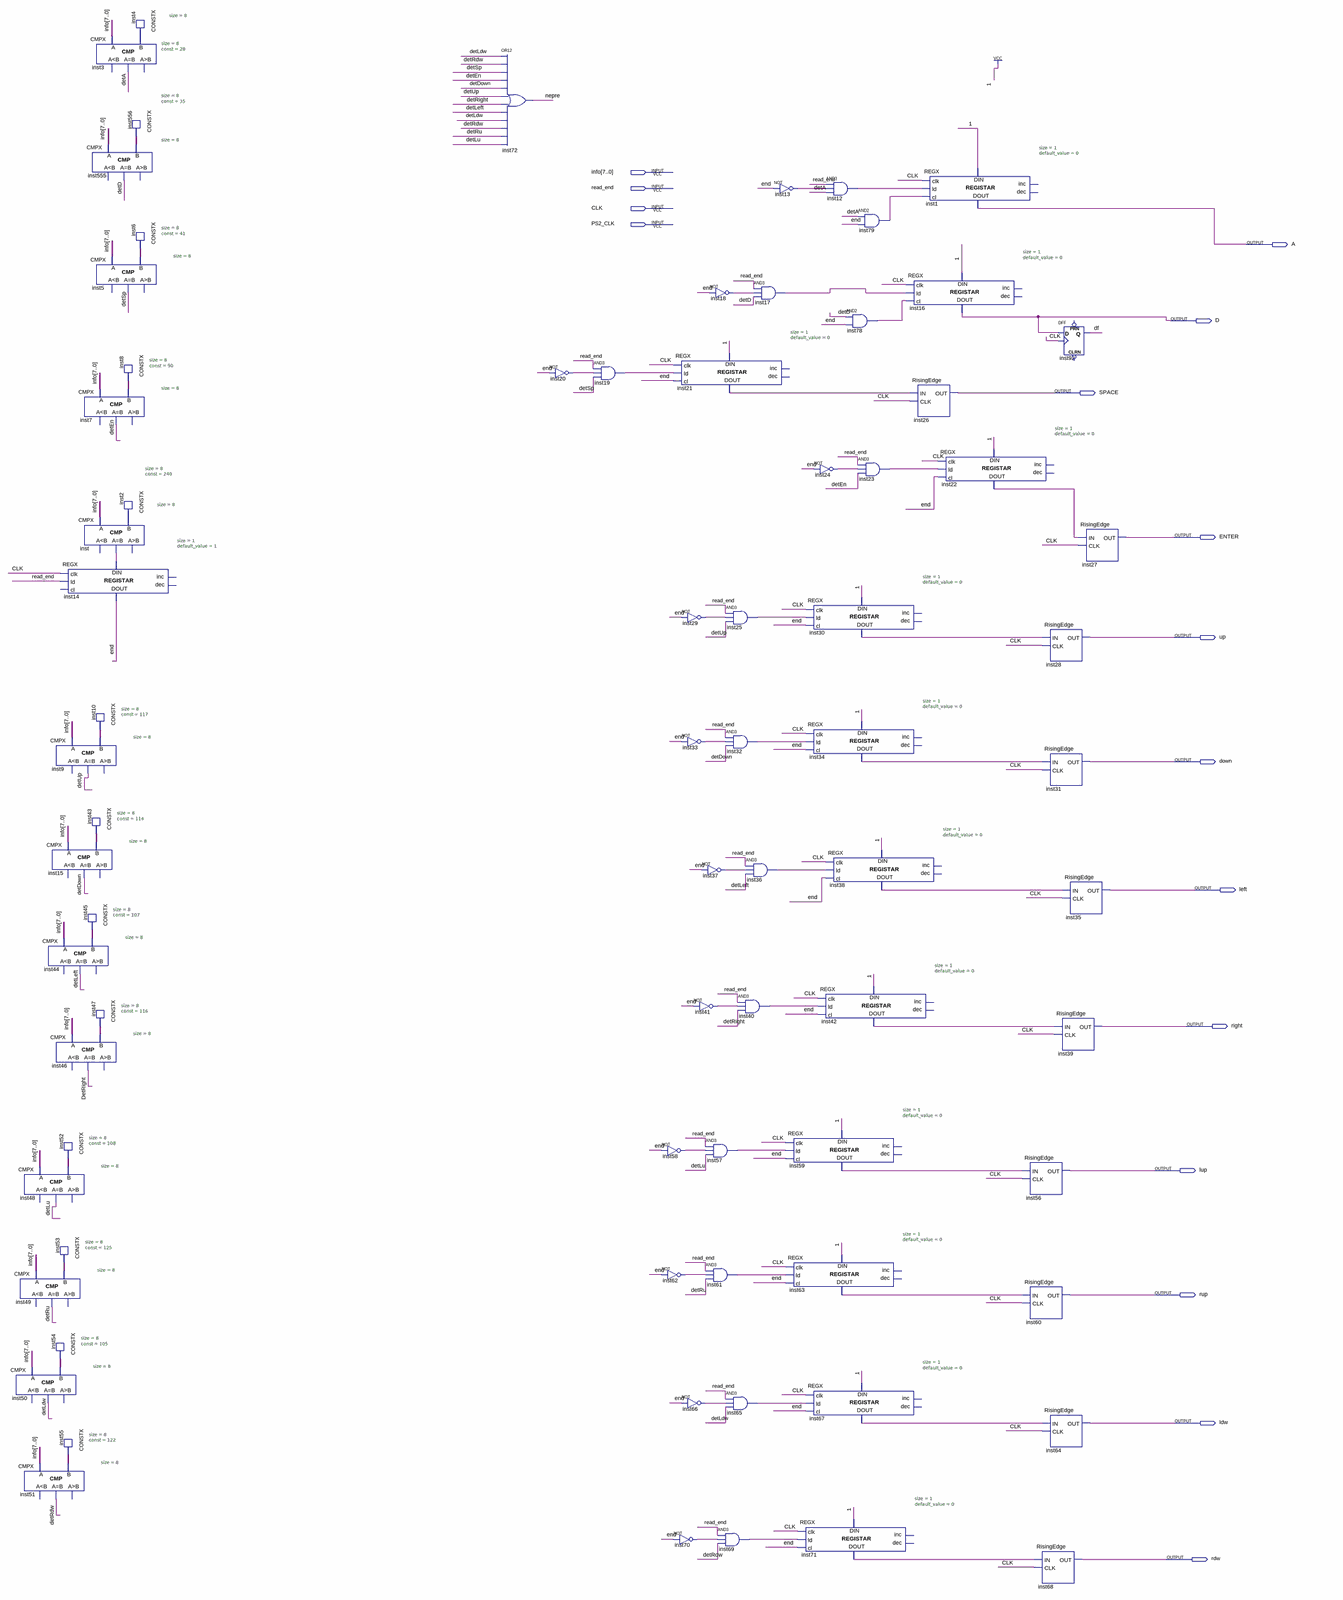
[diagram p0: schematic sheet, whole]
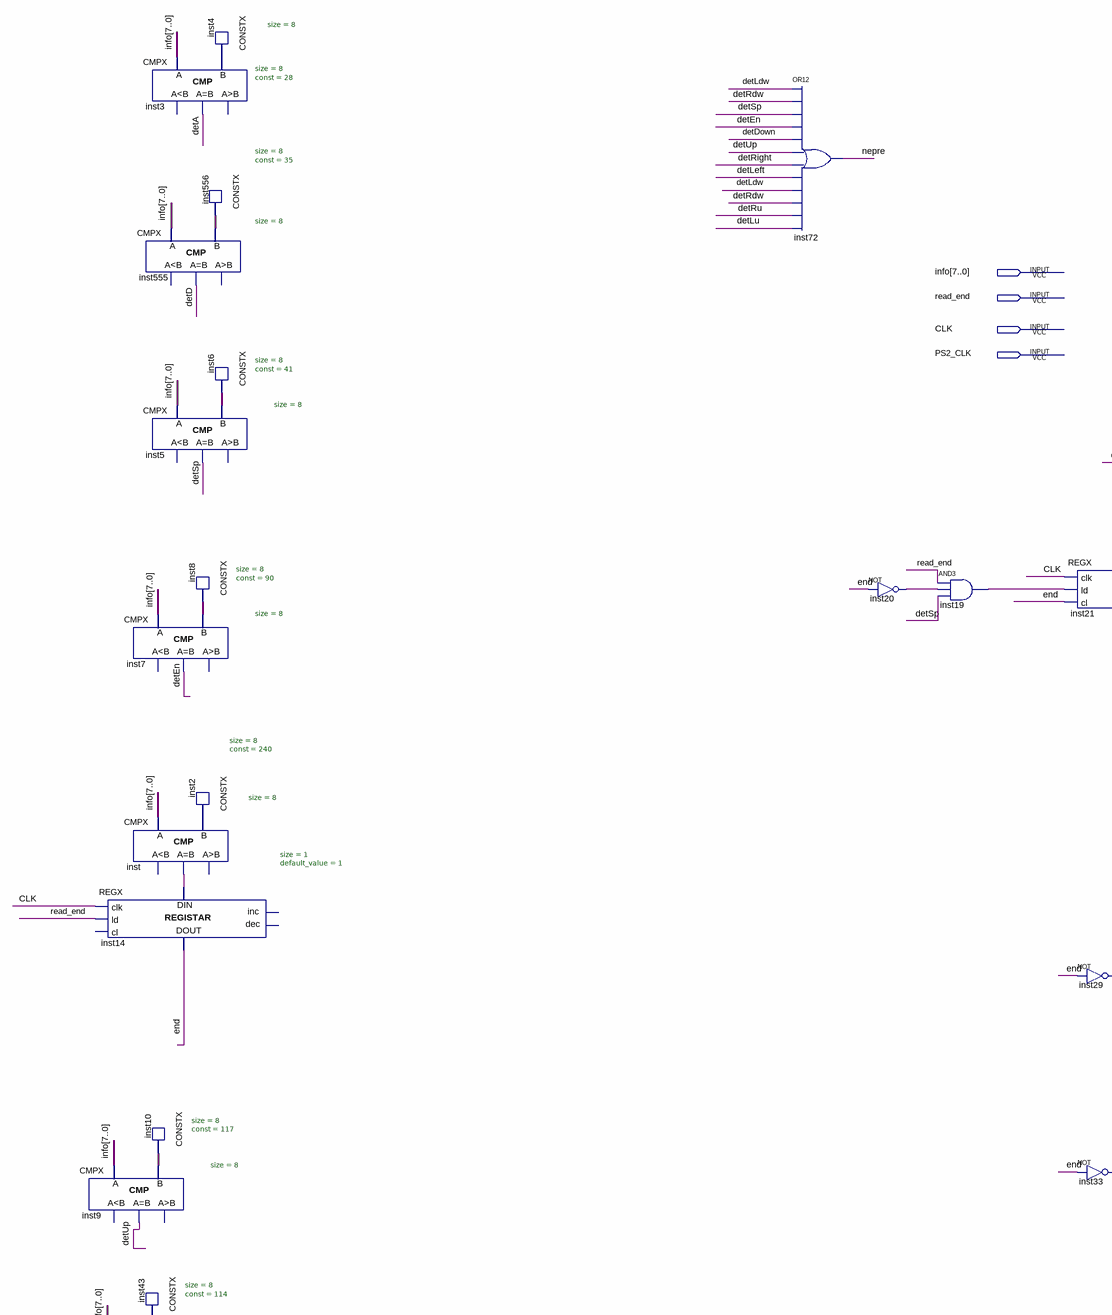
[diagram p1: schematic sheet, upper left part]
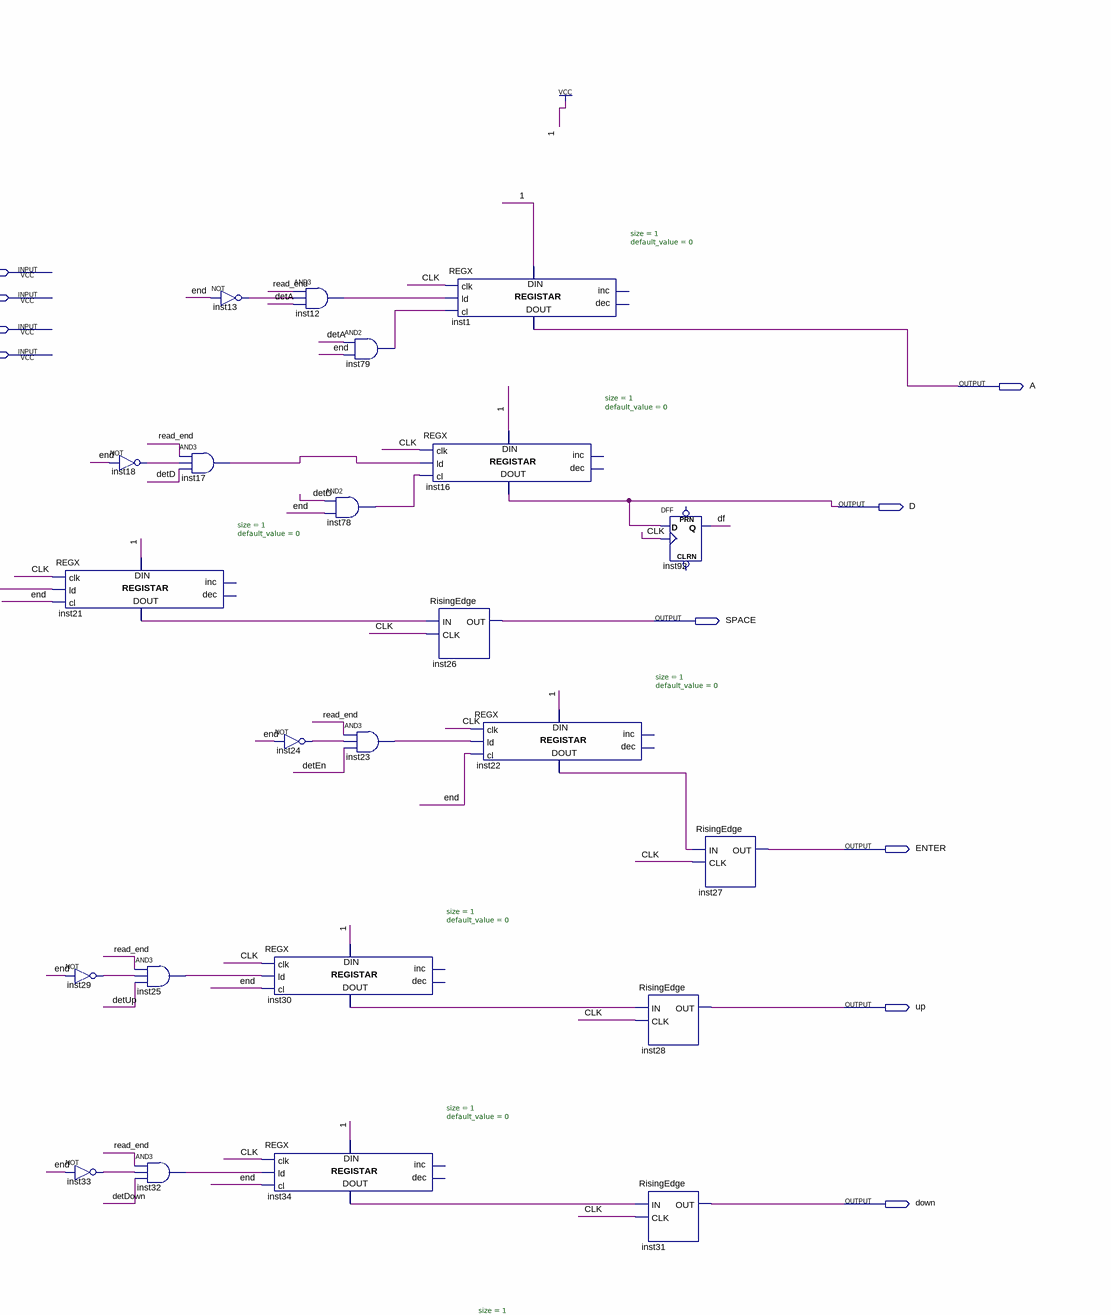
[diagram p2: schematic sheet, upper right part]
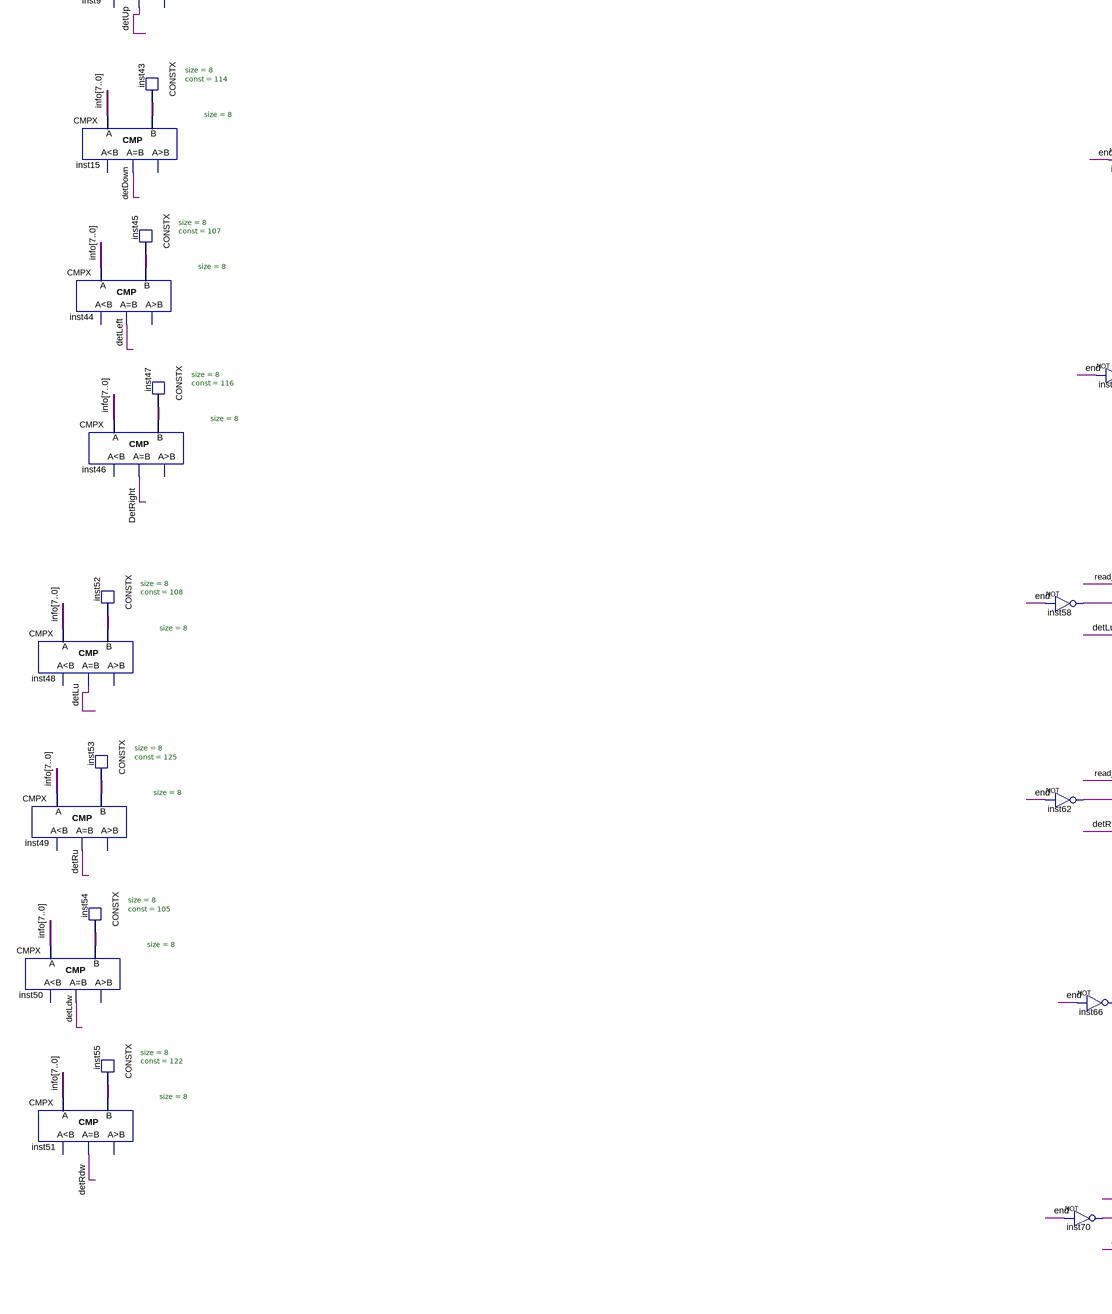
[diagram p3: schematic sheet, lower left part]
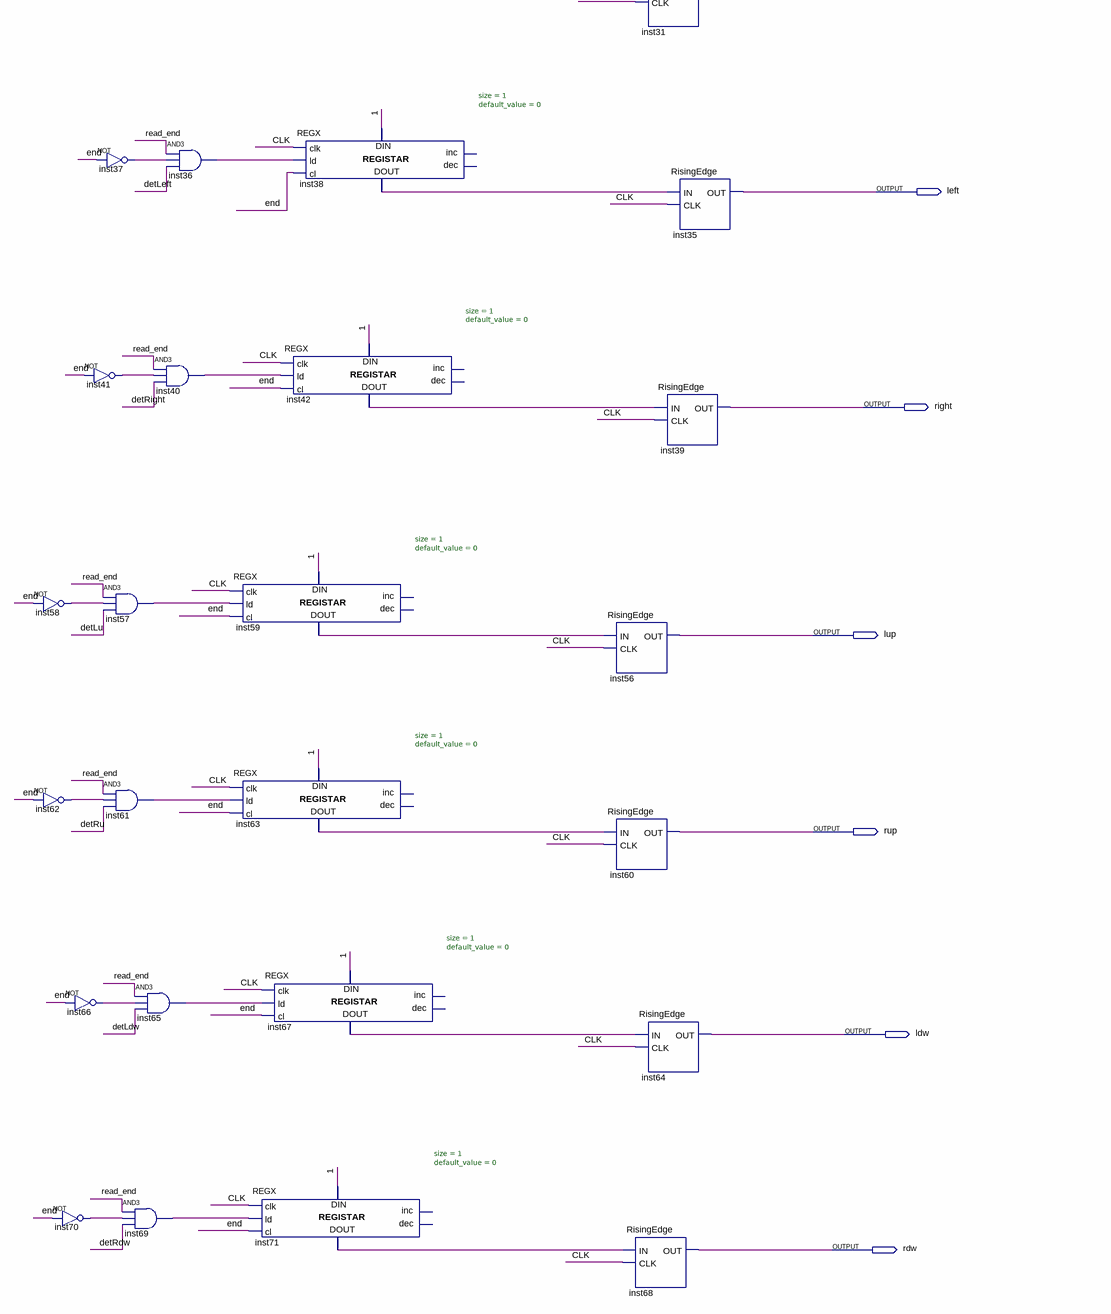
[diagram p4: schematic sheet, lower right part]
// Quartus schematic Tasteri.bdf as structural Verilog: 77 symbols, 16 pins
module Tasteri (
  input  [7:0] info,
  input  read_end,
  input  CLK,
  input  PS2_CLK,
  output A,
  output D,
  output SPACE,
  output ENTER,
  output up,
  output down,
  output left,
  output right,
  output lup,
  output rup,
  output ldw,
  output rdw
);

  wire detA, detD, detDown, detEn, detLdw, detLeft, detLu, detRdw, DetRight, detRu, detSp, detUp, df, \end ,
       inst12_out, inst13_out, inst17_out, inst18_out, inst19_out, inst20_out, inst21_data_out,
       inst22_data_out, inst23_out, inst24_out, inst25_out, inst29_out, inst30_data_out, inst32_out,
       inst33_out, inst34_data_out, inst36_out, inst37_out, inst38_data_out, inst40_out, inst41_out,
       inst42_data_out, inst57_out, inst58_out, inst59_data_out, inst61_out, inst62_out, inst63_data_out,
       inst65_out, inst66_out, inst67_data_out, inst69_out, inst70_out, inst71_data_out, inst78_out,
       inst79_out, inst_eq, nepre;
  wire [7:0] inst2_data, inst4_data, inst6_data, inst8_data, inst10_data, inst43_data, inst45_data,
       inst47_data, inst52_data, inst53_data, inst54_data, inst55_data, inst556_data;

  CMPX #(.size(8)) inst48 (.A(info), .B(inst52_data), .eq(detLu));  // open: ls, gr
  CMPX #(.size(8)) inst49 (.A(info), .B(inst53_data), .eq(detRu));  // open: ls, gr
  CMPX #(.size(8)) inst50 (.A(info), .B(inst54_data), .eq(detLdw));  // open: ls, gr
  CMPX #(.size(8)) inst51 (.A(info), .B(inst55_data), .eq(detRdw));  // open: ls, gr
  CMPX #(.size(8)) inst9 (.A(info), .B(inst10_data), .eq(detUp));  // open: ls, gr
  CMPX #(.size(8)) inst15 (.A(info), .B(inst43_data), .eq(detDown));  // open: ls, gr
  CMPX #(.size(8)) inst44 (.A(info), .B(inst45_data), .eq(detLeft));  // open: ls, gr
  CMPX #(.size(8)) inst46 (.A(info), .B(inst47_data), .eq(DetRight));  // open: ls, gr
  CONSTX #(.size(8), .\const (125)) inst53 (.data(inst53_data));
  CONSTX #(.size(8), .\const (105)) inst54 (.data(inst54_data));
  CMPX #(.size(8)) inst555 (.A(info), .B(inst556_data), .eq(detD));  // open: ls, gr
  CMPX #(.size(8)) inst7 (.A(info), .B(inst8_data), .eq(detEn));  // open: ls, gr
  CMPX #(.size(8)) inst (.A(info), .B(inst2_data), .eq(inst_eq));  // open: ls, gr
  REGX #(.size(1), .default_value(1)) inst14 (
    .clk(CLK), .ld(read_end), .data_in(inst_eq), .data_out(\end ));  // open: cl, inc, dec
  CONSTX #(.size(8), .\const (114)) inst43 (.data(inst43_data));
  CONSTX #(.size(8), .\const (107)) inst45 (.data(inst45_data));
  CONSTX #(.size(8), .\const (108)) inst52 (.data(inst52_data));
  CONSTX #(.size(8), .\const (122)) inst55 (.data(inst55_data));
  CMPX #(.size(8)) inst3 (.A(info), .B(inst4_data), .eq(detA));  // open: ls, gr
  CMPX #(.size(8)) inst5 (.A(info), .B(inst6_data), .eq(detSp));  // open: ls, gr
  CONSTX #(.size(8), .\const (90)) inst8 (.data(inst8_data));
  CONSTX #(.size(8), .\const (240)) inst2 (.data(inst2_data));
  CONSTX #(.size(8), .\const (117)) inst10 (.data(inst10_data));
  CONSTX #(.size(8), .\const (116)) inst47 (.data(inst47_data));
  CONSTX #(.size(8), .\const (28)) inst4 (.data(inst4_data));
  CONSTX #(.size(8), .\const (35)) inst556 (.data(inst556_data));
  CONSTX #(.size(8), .\const (41)) inst6 (.data(inst6_data));
  or inst72 (nepre, detLdw, detRdw, detSp, detEn, detDown, detUp, DetRight, detLeft, detLdw, detRdw, detRu, detLu);
  not inst20 (inst20_out, \end );
  and inst19 (inst19_out, read_end, inst20_out, detSp);
  not inst58 (inst58_out, \end );
  not inst62 (inst62_out, \end );
  REGX #(.size(1), .default_value(0)) inst21 (
    .clk(CLK), .ld(inst19_out), .cl(\end ), .data_in(1'b1), .data_out(inst21_data_out));  // open: inc, dec
  not inst29 (inst29_out, \end );
  not inst33 (inst33_out, \end );
  not inst41 (inst41_out, \end );
  not inst66 (inst66_out, \end );
  not inst70 (inst70_out, \end );
  not inst18 (inst18_out, \end );
  and inst25 (inst25_out, read_end, inst29_out, detUp);
  and inst32 (inst32_out, read_end, inst33_out, detDown);
  not inst37 (inst37_out, \end );
  and inst57 (inst57_out, read_end, inst58_out, detLu);
  and inst61 (inst61_out, read_end, inst62_out, detRu);
  and inst65 (inst65_out, read_end, inst66_out, detLdw);
  and inst69 (inst69_out, read_end, inst70_out, detRdw);
  and inst17 (inst17_out, read_end, inst18_out, detD);
  and inst36 (inst36_out, read_end, inst37_out, detLeft);
  and inst40 (inst40_out, read_end, inst41_out, DetRight);
  not inst13 (inst13_out, \end );
  REGX #(.size(1), .default_value(0)) inst59 (
    .clk(CLK), .ld(inst57_out), .cl(\end ), .data_in(1'b1), .data_out(inst59_data_out));  // open: inc, dec
  REGX #(.size(1), .default_value(0)) inst63 (
    .clk(CLK), .ld(inst61_out), .cl(\end ), .data_in(1'b1), .data_out(inst63_data_out));  // open: inc, dec
  not inst24 (inst24_out, \end );
  REGX #(.size(1), .default_value(0)) inst30 (
    .clk(CLK), .ld(inst25_out), .cl(\end ), .data_in(1'b1), .data_out(inst30_data_out));  // open: inc, dec
  REGX #(.size(1), .default_value(0)) inst34 (
    .clk(CLK), .ld(inst32_out), .cl(\end ), .data_in(1'b1), .data_out(inst34_data_out));  // open: inc, dec
  REGX #(.size(1), .default_value(0)) inst42 (
    .clk(CLK), .ld(inst40_out), .cl(\end ), .data_in(1'b1), .data_out(inst42_data_out));  // open: inc, dec
  REGX #(.size(1), .default_value(0)) inst67 (
    .clk(CLK), .ld(inst65_out), .cl(\end ), .data_in(1'b1), .data_out(inst67_data_out));  // open: inc, dec
  REGX #(.size(1), .default_value(0)) inst71 (
    .clk(CLK), .ld(inst69_out), .cl(\end ), .data_in(1'b1), .data_out(inst71_data_out));  // open: inc, dec
  and inst12 (inst12_out, read_end, inst13_out, detA);
  and inst78 (inst78_out, detD, \end );
  REGX #(.size(1), .default_value(0)) inst38 (
    .clk(CLK), .ld(inst36_out), .cl(\end ), .data_in(1'b1), .data_out(inst38_data_out));  // open: inc, dec
  and inst79 (inst79_out, detA, \end );
  and inst23 (inst23_out, read_end, inst24_out, detEn);
  REGX #(.size(1), .default_value(0)) inst16 (
    .clk(CLK), .ld(inst17_out), .cl(inst78_out), .data_in(1'b1), .data_out(D));  // open: inc, dec
  RisingEdge inst26 (.IN(inst21_data_out), .CLK(CLK), .OUT(SPACE));
  REGX #(.size(1), .default_value(0)) inst1 (
    .clk(CLK), .ld(inst12_out), .cl(inst79_out), .data_in(1'b1), .data_out(A));  // open: inc, dec
  REGX #(.size(1), .default_value(0)) inst22 (
    .clk(CLK), .ld(inst23_out), .cl(\end ), .data_in(1'b1), .data_out(inst22_data_out));  // open: inc, dec
  RisingEdge inst28 (.IN(inst30_data_out), .CLK(CLK), .OUT(up));
  RisingEdge inst31 (.IN(inst34_data_out), .CLK(CLK), .OUT(down));
  RisingEdge inst56 (.IN(inst59_data_out), .CLK(CLK), .OUT(lup));
  RisingEdge inst60 (.IN(inst63_data_out), .CLK(CLK), .OUT(rup));
  RisingEdge inst64 (.IN(inst67_data_out), .CLK(CLK), .OUT(ldw));
  RisingEdge inst68 (.IN(inst71_data_out), .CLK(CLK), .OUT(rdw));
  DFF inst92 (.CLK(CLK), .D(D), .Q(df));  // open: CLRN, PRN
  RisingEdge inst27 (.IN(inst22_data_out), .CLK(CLK), .OUT(ENTER));
  RisingEdge inst35 (.IN(inst38_data_out), .CLK(CLK), .OUT(left));
  RisingEdge inst39 (.IN(inst42_data_out), .CLK(CLK), .OUT(right));
endmodule
